# Altium project PROC101D_SCH_With_Design_Updates..Notes_V1.0.PrjPcb (part 20 of 23)

## Sheet 38.SchDoc
size 513 x 386 mm
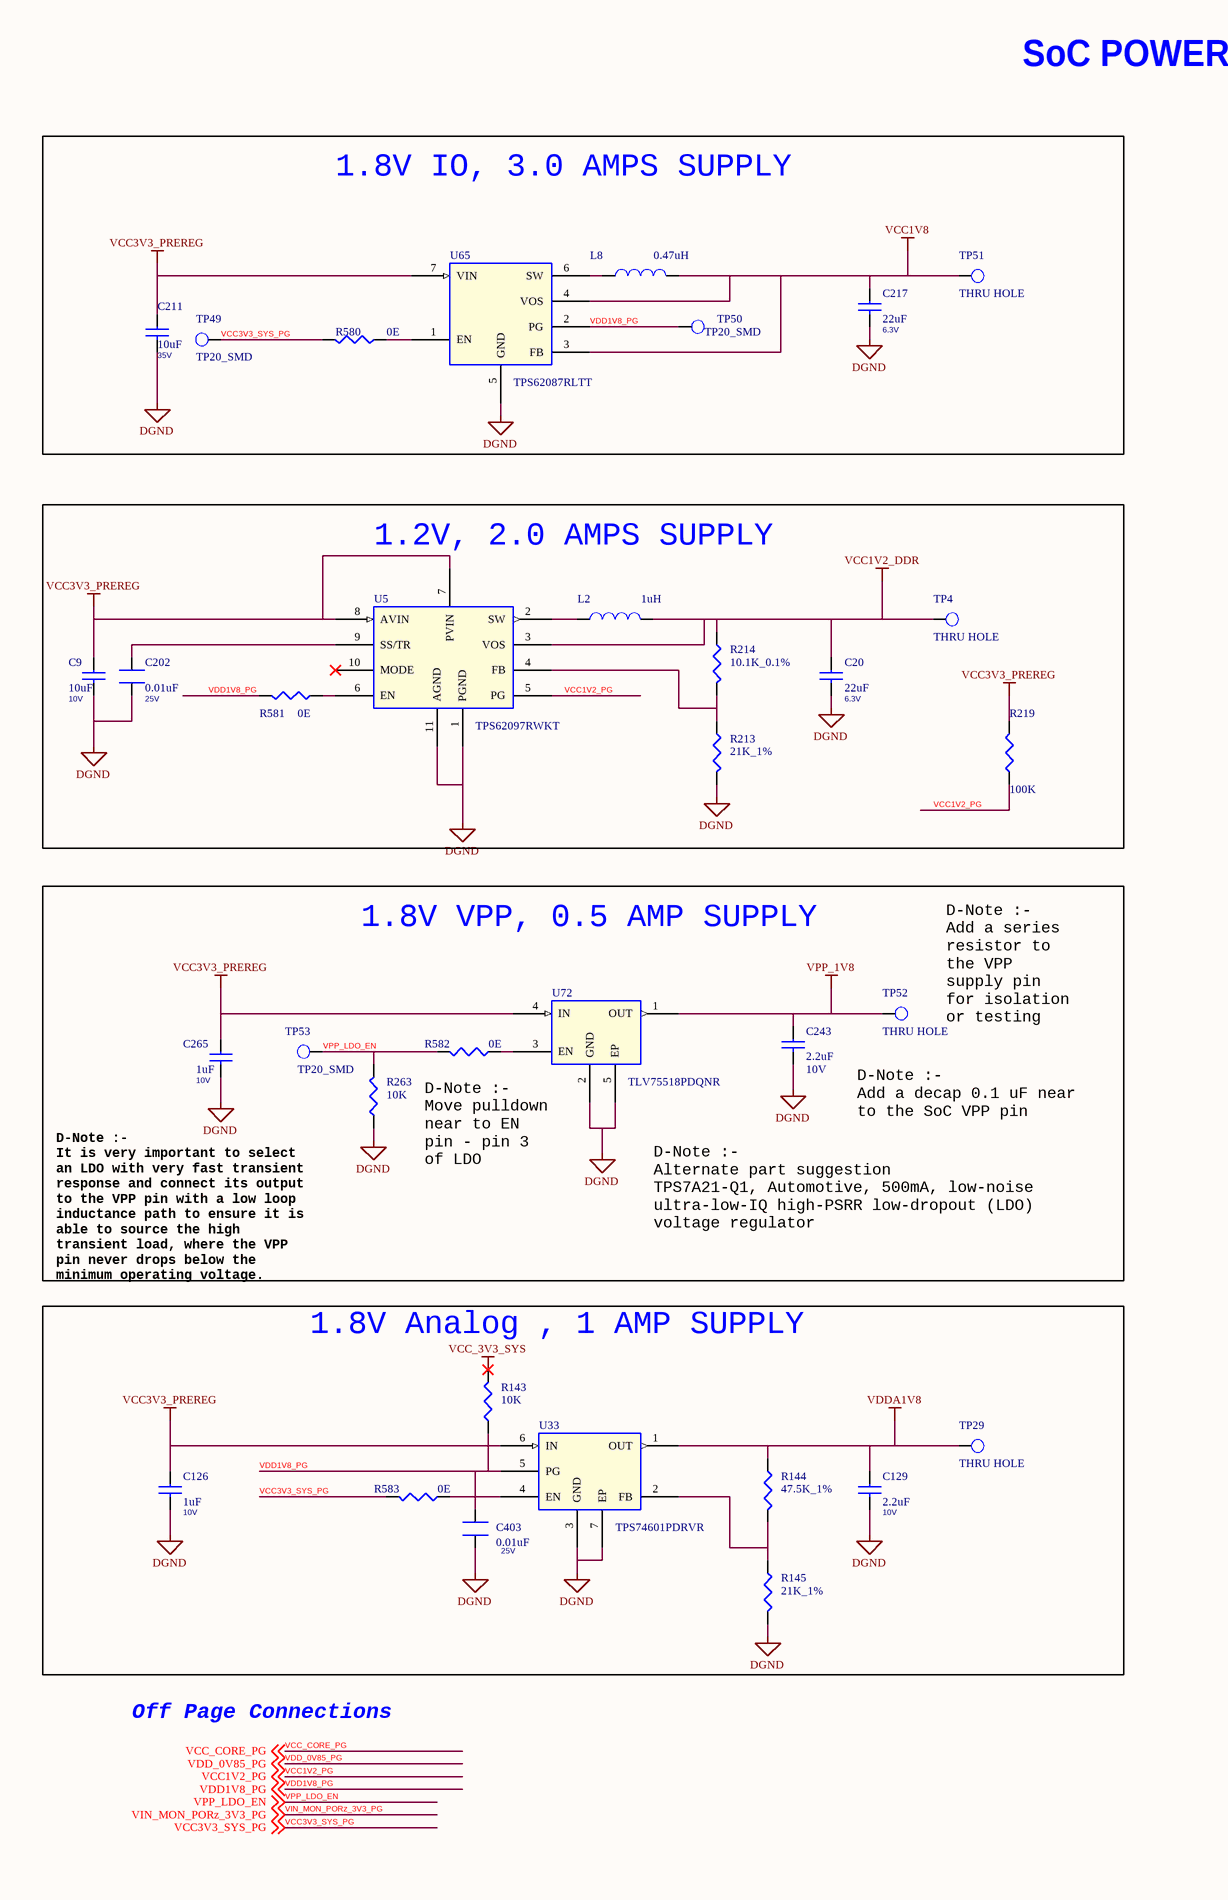
[diagram p72: 38.SchDoc, left]
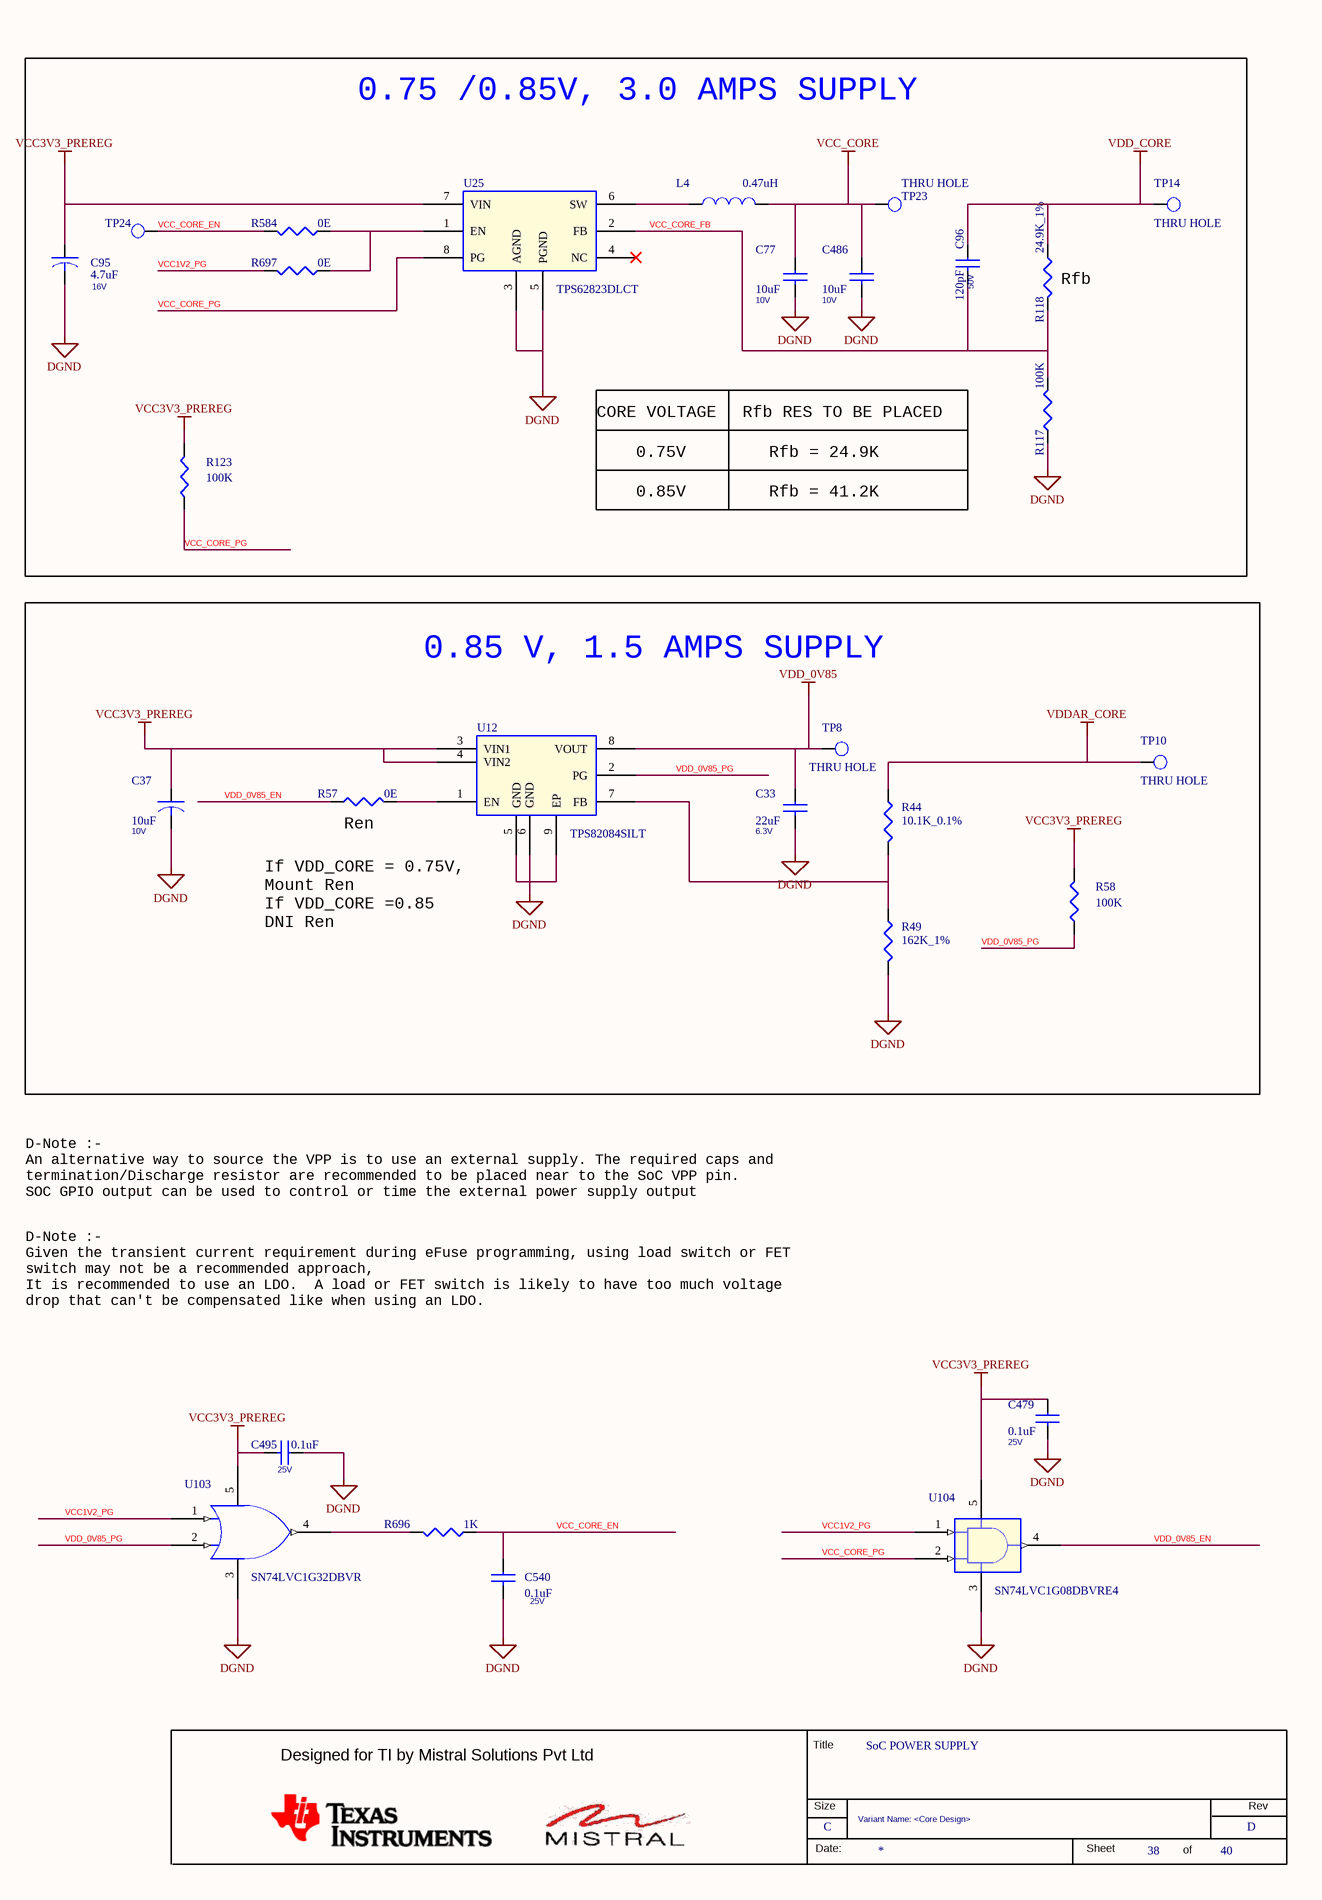
[diagram p73: 38.SchDoc, right]

### Parts
(Parts that share a designator on the sheet are numbered #1, #2 ... from top to bottom, then left to right.)
*#38  RevCode: D  Title: SoC POWER SUPPLY  Page Size: C  Page Number: 38  Page Count: 40  Variant Name: <Core Design>  (hidden comment: MISTRAL_TITLEBLK_CSIZE)  (graphical)
C9  10uF  Voltage: 10V  [CAP0402_0-75]
C20  22uF  Voltage: 6.3V  [CAP0603_1]
C33  22uF  Voltage: 6.3V  [CAP0603_1]
C37  10uF  Voltage: 10V  [CAP0402_0-75]
C77  10uF  Voltage: 10V  [CAP0402_0-75]
C95  4.7uF  Voltage: 16V  [CAP0603_1]
C96  120pF  Voltage: 50V  [CAP0402_0-75]
C126  1uF  Voltage: 10V  [CAP0402_0-75]
C129  2.2uF  Voltage: 10V  [CAP0402_0-75]
C202  0.01uF  Voltage: 25V  [CAP0402N]
C211  10uF  Voltage: 35V  [CAP0603_1]
C217  22uF  Voltage: 6.3V  [CAP0603_1]
C243  2.2uF  Voltage: 10V  [CAP0402_0-75]
C265  1uF  Voltage: 10V  [CAP0402_0-75]
C403  0.01uF  Voltage: 25V  [CAP0402N]
C479  0.1uF  Voltage: 25V  [CAP0402_0-75]
C486  10uF  Voltage: 10V  [CAP0402_0-75]
C495  0.1uF  Voltage: 25V  [CAP0402_0-75]
C540  0.1uF  Voltage: 25V  [CAP0402_0-75]
L2  1uH  [IND_744316100_230X220_SMD_4-3]
L4  0.47uH  [IND_744373460047_270X270_SMD_3]
L8  0.47uH  [IND_744373460047_270X270_SMD_3]
R44  10.1K_0.1%  [RES0603_0-75]
R49  162K_1%  [RES0402_0-5]
R57  0E  [RES0402_0-5]
R58  100K  [RES0402_0-5]
R117  100K  [RES0402_0-5]
R118  24.9K_1%  [RES0402_0-5]
R123  100K  [RES0402_0-5]
R143  10K  [RES0402_0-5]
R144  47.5K_1%  [RES0402_0-5]
R145  21K_1%  [RES0402_0-5]
R213  21K_1%  [RES0402_0-5]
R214  10.1K_0.1%  [RES0603_0-75]
R219  100K  [RES0402_0-5]
R263  10K  [RES0402_0-5]
R580  0E  [RES0402_0-5]
R581  0E  [RES0402_0-5]
R582  0E  [RES0402_0-5]
R583  0E  [RES0402_0-5]
R584  0E  [RES0402_0-5]
R696  1K  [RES0402_0-5]
R697  0E  [RES0402_0-5]
TP4  THRU HOLE  [TP_40X65]
TP8  THRU HOLE  [TP_40X65]
TP10  THRU HOLE  [TP_40X65]
TP14  THRU HOLE  [TP_40X65]
TP23  THRU HOLE  [TP_40X65]
TP24  TP20_SMD  [TP20_SMD]  (value not drawn)
TP29  THRU HOLE  [TP_40X65]
TP49  TP20_SMD  [TP20_SMD]
TP50  TP20_SMD  [TP20_SMD]
TP51  THRU HOLE  [TP_40X65]
TP52  THRU HOLE  [TP_40X65]
TP53  TP20_SMD  [TP20_SMD]
U5  TPS62097RWKT  [VQFNHR11_TPS62097_80X80_1]
U12  TPS82084SILT  [uSIP8_TPS82084_110X120_1-4]
U25  TPS62823DLCT  [VSONHR8_TPS62823_60X80_1]
U33  TPS74601PDRVR  [SON6_25-59_85X85_0-8]
U65  TPS62087RLTT  [VSONHR7_TPS62085_80X80_1]
U72  TLV75518PDQNR  [X2SON4_TLV71318P_40X40_0-4]
U103  SN74LVC1G32DBVR  [SOT23-5_1-5]
U104  SN74LVC1G08DBVRE4  [SOT23-5]

### Blocks framed on the sheet
1.8V IO, 3.0 AMPS SUPPLY: C211 C217 L8 R580 TP49-TP51 U65
0.75 /0.85V, 3.0 AMPS SUPPLY: C77 C95 C96 C486 L4 R117 R118 R123 R584 R697 TP14 TP23 TP24 U25
1.2V, 2.0 AMPS SUPPLY: C9 C20 C202 L2 R213 R214 R219 R581 TP4 U5
0.85 V, 1.5 AMPS SUPPLY: C33 C37 R44 R49 R57 R58 TP8 TP10 U12
1.8V VPP, 0.5 AMP SUPPLY: C243 C265 R263 R582 TP52 TP53 U72
1.8V Analog , 1 AMP SUPPLY: C126 C129 C403 R143-R145 R583 TP29 U33

### Nets
DGND: C9.2 C20.2 C33.2 C37.2 C77.2 C95.2 C126.2 C129.2 C202.2 C211.2 C217.2 C243.2 C265.2 C403.2 C479.2 C486.2 C495.1 C540.2 R49.2 R117.1 R145.2 R213.2 R263.1 U5.1(PGND) U5.11(AGND) U12.6(GND) U25.3(AGND) U25.5(PGND) U33.3(GND) U33.7(EP) U65.5(GND) U72.2(GND) U72.5(EP) U103.3(GND) U104.3(GND)
VCC1V2_DDR: C20.1 L2.2 R214.1 TP4.1(TP) U5.3(VOS)
VCC1V8: C217.1 L8.2 TP51.1(TP) U65.3(FB) U65.4(VOS)
VCC3V3_PREREG: C9.1 C37.1 C95.1 C126.1 C211.1 C265.1 C479.1 C495.2 R58.2 R123.2 R219.2 U5.7(PVIN) U5.8(AVIN) U12.3(VIN1) U12.4(VIN2) U25.7(VIN) U33.6(IN) U65.7(VIN) U72.4(IN) U103.5(VCC) U104.5(VCC)
VCC_3V3_SYS: R143.2
VCC_CORE: C77.1 C486.1 L4.2 TP23.1(TP)
VDD_0V85: C33.1 TP8.1(TP) U12.8(VOUT)
VDD_CORE: C96.1 R118.1 TP14.1(TP)
VDDA1V8: C129.1 R144.1 TP29.1(TP) U33.1(OUT)
VDDAR_CORE: R44.1 TP10.1(TP)
VPP_1V8: C243.1 TP52.1(TP) U72.1(OUT)
VCC1V2_PG: R219.1 R697.2 U5.5(PG) U103.1(A) U104.1(A) ; off-sheet VCC1V2_PG
VCC3V3_SYS_PG: R580.2 R583.2 TP49.1(TP) ; off-sheet VCC3V3_SYS_PG
VCC_CORE_EN: C540.1 R584.2 R696.1 TP24.1(TP)
VCC_CORE_FB: C96.2 R117.2 R118.2 U25.2(FB)
VCC_CORE_PG: R123.1 U25.8(PG) U104.2(B) ; off-sheet VCC_CORE_PG
VDD1V8_PG: C403.1 R143.1 R581.2 TP50.1(TP) U33.5(PG) U65.2(PG) ; off-sheet VDD1V8_PG
VDD_0V85_EN: R57.1 U104.4(Y)
VDD_0V85_PG: R58.1 U12.2(PG) U103.2(B) ; off-sheet VDD_0V85_PG
VPP_LDO_EN: R263.2 R582.2 TP53.1(TP) ; off-sheet VPP_LDO_EN
NetC202_1: C202.1 U5.9(SS/TR)
NetL2_1: L2.1 U5.2(SW)
NetL4_1: L4.1 U25.6(SW)
NetL8_1: L8.1 U65.6(SW)
NetR44_2: R44.2 R49.1 U12.7(FB)
NetR57_2: R57.2 U12.1(EN)
NetR144_2: R144.2 R145.1 U33.2(FB)
NetR213_1: R213.1 R214.2 U5.4(FB)
NetR580_1: R580.1 U65.1(EN)
NetR581_1: R581.1 U5.6(EN)
NetR582_1: R582.1 U72.3(EN)
NetR583_1: R583.1 U33.4(EN)
NetR584_1: R584.1 R697.1 U25.1(EN)
NetR696_2: R696.2 U103.4(Y)
NetU12_5: U12.5(GND) U12.9(EP)

Not connected (* = marked no-connect by the designer): U5 10(MODE)*; U25 4(NC)*

### Notes on the sheet
- SoC POWER SUPPLIES
- (near R118) Rfb
- CORE VOLTAGE
- Rfb RES TO BE PLACED
- 0.75V
- 0.85V
- Rfb = 24.9K
- Rfb = 41.2K
- (near R57) Ren
- D-Note :-
  Add a series
  resistor to
  the VPP
  supply pin
  for isolation
  or testing
- If VDD_CORE = 0.75V,
  Mount Ren
  If VDD_CORE =0.85
  DNI Ren
- (near U72) D-Note :-
  Move pulldown
  near to EN
  pin - pin 3
  of LDO
- D-Note :-
  Add a decap 0.1 uF near
  to the SoC VPP pin
- D-Note :-
  It is very important to select
  an LDO with very fast transient
  response and connect its output
  to the VPP pin with a low loop
  inductance path to ensure it is
  able to source the high
  transient load, where the VPP
  pin never drops below the
  minimum operating voltage.
- D-Note :-
  Alternate part suggestion
  TPS7A21-Q1, Automotive, 500mA, low-noise
  ultra-low-IQ high-PSRR low-dropout (LDO)
  voltage regulator
- D-Note :-
  An alternative way to source the VPP is to use an external supply. The required caps and
  termination/Discharge resistor are recommended to be placed near to the SoC VPP pin.
  SOC GPIO output can be used to control or time the external power supply output
- D-Note :-
  Given the transient current requirement during eFuse programming, using load switch or FET
  switch may not be a recommended approach,
  It is recommended to use an LDO.  A load or FET switch is likely to have too much voltage
  drop that can't be compensated like when using an LDO.
- Off Page Connections
- (in symbol MISTRAL_TITLEBLK_CSIZE) Title; Designed for TI by Mistral Solutions Pvt Ltd; Size; Rev; Date:; Sheet; of

### Library data of the parts
*#38 = MISTRAL_TITLEBLK_CSIZE: Issue: 1.0; Page Create Date: March  8, 1995; Page Modify Date: *
C9 C486 = CAP_Dup3: CAP CERAMIC 10uF 10V 20% X5R 0402; Part_type: CAPACITORS\CERAMIC; Mfr_part_number: GRM155R61A106ME11D; Mfr_name: MURATA; Mistral Part No: 120013110019-R; Custom_Duty: 15%; Customs_HS_Code: 85322990; Wattage: NA; Project: QCS610_NANOSOM; Footprint Path: Y:\MIS_DATABASE\Library\ALTIUM_TOOL\PCB_FOOTPRINTS\Altium_Footprint_Lib.PcbLib; Library Path: Y:\MIS_DATABASE\Library\ALTIUM_TOOL\SCHEMATICS_PARTS\MS_DISCRETE_Library.schlib; Footprint Ref: CAP0402_0-75; Library Ref: CAP; MECHANICAL 3D STEP FILE: CAP0402_0-75; Chkd/date: MANIRAJA/300520; Crtd /date: ALVY/260520; Datasheet: Y:\MIS_DATABASE\DATASHEETS\CAPACITORS\MURATA-GXX-SER_NOV17.PDF; Temperature: -55癈+85癈; Weight: 3.1mg; Height: 0.55MM; Distributor_part_number: 490-GRM155R61A106ME11DTR-ND; Distributor_name: DIGIKEY; Package: 0402; Tolerance: 20%; PCB Footprint: CAP0402_0-75
C20 C33 = CAP_Dup3: as C40 on sheet 37; Footprint Path: Y:\MIS_DATABASE\Library\ALTIUM_TOOL\PCB_FOOTPRINTS\Altium_Footprint_Lib.PcbLib; Library Path: Y:\MIS_DATABASE\Library\ALTIUM_TOOL\SCHEMATICS_PARTS\MS_DISCRETE_Library.schlib; MECHANICAL 3D STEP FILE: CAP0603_1; Footprint Ref: CAP0603_1; Library Ref: CAP; Tolerance: 20%; Package: 0603; Distributor_name: DIGIKEY; Distributor_part_number: 490-7611-2-ND; Height: 1.00MM; Weight: 6.3mg; Temperature: -55癈+85癈; Datasheet: Y:\MIS_DATABASE\DATASHEETS\CAPACITORS\MURATA-GXX-SER_NOV17.PDF; Crtd /date: JEBRAN/090915; Chkd/date: JEBRAN/090915; PCB Footprint: CAP0603_1
C37 = CAP_Dup1: CAP CERAMIC 10uF 10V 20% X5R 0402; Mistral Part No: 120013110019-R; Mfr_name: MURATA; Mfr_part_number: GRM155R61A106ME11D; Part_type: CAPACITORS\CERAMIC; Project: QCS610_NANOSOM; Wattage: NA; Customs_HS_Code: 85322990; Custom_Duty: 15%; Footprint Path: Y:\MIS_DATABASE\Library\ALTIUM_TOOL\PCB_FOOTPRINTS\Altium_Footprint_Lib.PcbLib; Library Path: Y:\MIS_DATABASE\Library\ALTIUM_TOOL\SCHEMATICS_PARTS\MS_DISCRETE_Library.schlib; Footprint Ref: CAP0402_0-75; Library Ref: CAP; MECHANICAL 3D STEP FILE: CAP0402_0-75; Tolerance: 20%; Package: 0402; Distributor_name: DIGIKEY; Distributor_part_number: 490-GRM155R61A106ME11DTR-ND; Height: 0.55MM; Weight: 3.1mg; Temperature: -55癈+85癈; Datasheet: Y:\MIS_DATABASE\DATASHEETS\CAPACITORS\MURATA-GXX-SER_NOV17.PDF; Crtd /date: ALVY/260520; Chkd/date: MANIRAJA/300520; PCB Footprint: CAP0402_0-75
C77 = CAP_Dup3: CAP CERAMIC 10uF 10V 20% X5R 0402; Mistral Part No: 120013110019-R; Mfr_name: MURATA; Mfr_part_number: GRM155R61A106ME11D; Part_type: CAPACITORS\CERAMIC; Project: QCS610_NANOSOM; Wattage: NA; Customs_HS_Code: 85322990; Custom_Duty: 15%; Tolerance: 20%; Package: 0402; Distributor_name: DIGIKEY; Distributor_part_number: 490-GRM155R61A106ME11DTR-ND; Height: 0.55MM; Weight: 3.1mg; Temperature: -55癈+85癈; Datasheet: Y:\MIS_DATABASE\DATASHEETS\CAPACITORS\MURATA-GXX-SER_NOV17.PDF; Crtd /date: ALVY/260520; Chkd/date: MANIRAJA/300520; MECHANICAL 3D STEP FILE: CAP0402_0-75; Library Ref: CAP; Footprint Ref: CAP0402_0-75; Library Path: Y:\MIS_DATABASE\Library\ALTIUM_TOOL\SCHEMATICS_PARTS\MS_DISCRETE_Library.schlib; Footprint Path: Y:\MIS_DATABASE\Library\ALTIUM_TOOL\PCB_FOOTPRINTS\Altium_Footprint_Lib.PcbLib; PCB Footprint: CAP0402_0-75
C95 = CAP_Dup1: CAP CERAMIC 4.7uF 16V 10% X5R 0603; Part_type: CAPACITORS\CERAMIC; Mfr_part_number: CC0603KRX5R7BB475; Mfr_name: YAGEO AMERICA; Mistral Part No: 120011050004-R; Custom_Duty: 15%; Customs_HS_Code: 85322990; Wattage: NA; Project: ASL_LIU_TYPE-II; Footprint Path: Y:\MIS_DATABASE\Library\ALTIUM_TOOL\PCB_FOOTPRINTS\Altium_Footprint_Lib.PcbLib; Library Path: Y:\MIS_DATABASE\Library\ALTIUM_TOOL\SCHEMATICS_PARTS\MS_DISCRETE_Library.schlib; MECHANICAL 3D STEP FILE: CAP0603_1; Chkd/date: MANIRAJA/131217; Crtd /date: ALVY/131217; Datasheet: Y:\MIS_DATABASE\DATASHEETS\CAPACITORS\YACC-X5R.PDF; Temperature: -55癈+85癈; Weight: 2mg; Height: 0.95MM; Library Ref: CAP; Distributor_part_number: 311-1785-1-ND; Distributor_name: DIGIKEY; Package: 0603; Tolerance: 10%; Footprint Ref: CAP0603_1; PCB Footprint: CAP0603_1
C96 = CAP: CAP CERAMIC 120pF 50V 5% C0G(NP0) 0402; Part_type: CAPACITORS\CERAMIC; Mfr_part_number: CC0402JRNPO9BN121; Mfr_name: YAGEO AMERICA; Mistral Part No: 120014040005-R; Custom_Duty: 15%; Customs_HS_Code: 85322990; Wattage: NA; Project: AM64x-GP_EVM BRD; Footprint Path: Y:\MIS_DATABASE\Library\ALTIUM_TOOL\PCB_FOOTPRINTS\Altium_Footprint_Lib.PcbLib; Library Path: Y:\MIS_DATABASE\Library\ALTIUM_TOOL\SCHEMATICS_PARTS\MS_DISCRETE_Library.schlib; MECHANICAL 3D STEP FILE: CAP0402_0-75; Chkd/date: MANIRAJA/080520; Crtd /date: ALVY/070520; Datasheet: Y:\MIS_DATABASE\DATASHEETS\CAPACITORS\YACC-NPO.PDF; Temperature: -55癈+125癈; Weight: 12mg; Height: 0.55MM; Library Ref: CAP; Distributor_part_number: 311-3337-1-ND; Distributor_name: DIGIKEY; Package: 0402; Tolerance: 5%; Footprint Ref: CAP0402_0-75; PCB Footprint: CAP0402_0-75
C126 C265 = CAP_Dup3: as C137 on sheet 37; PCB Footprint: CAP0402_0-75; Library Ref: CAP; MECHANICAL 3D STEP FILE: CAP0402_0-75; Chkd/date: MANIRAJA/210820; Crtd /date: ALVY/190820; Datasheet: Y:\MIS_DATABASE\DATASHEETS\CAPACITORS\885012105012.PDF; Temperature: -55癈+85癈; Weight: 0.65mg; Height: 0.55MM; Distributor_part_number: 732-7489-1-ND; Distributor_name: DIGIKEY; Package: 0402; Tolerance: 20%; Footprint Ref: CAP0402_0-75; Library Path: Y:\MIS_DATABASE\Library\ALTIUM_TOOL\SCHEMATICS_PARTS\MS_DISCRETE_Library.schlib; Footprint Path: Y:\MIS_DATABASE\Library\ALTIUM_TOOL\PCB_FOOTPRINTS\Altium_Footprint_Lib.PcbLib
C129 C243 = CAP_Dup3: CAP CERAMIC 2.2uF 10V 20% X5R 0402; Mistral Part No: 120019040036-R; Mfr_name: WURTH ELECTRONICS; Mfr_part_number: 885012105013; Part_type: CAPACITORS\CERAMIC; Project: AM64x_EVM_BRD; Wattage: NA; Customs_HS_Code: 85322990; Custom_Duty: 15%; PCB Footprint: CAP0402_0-75; Library Ref: CAP; Tolerance: 20%; Package: 0402; Distributor_name: DIGIKEY; Distributor_part_number: 732-7490-1-ND; Height: 0.55MM; Weight: 0.65mg; Temperature: -55癈+85癈; Datasheet: Y:\MIS_DATABASE\DATASHEETS\CAPACITORS\885012105013.PDF; Crtd /date: ALVY/170820; Chkd/date: MANIRAJA/170820; MECHANICAL 3D STEP FILE: CAP0402_0-75; Footprint Ref: CAP0402_0-75; Library Path: Y:\MIS_DATABASE\Library\ALTIUM_TOOL\SCHEMATICS_PARTS\MS_DISCRETE_Library.schlib; Footprint Path: Y:\MIS_DATABASE\Library\ALTIUM_TOOL\PCB_FOOTPRINTS\Altium_Footprint_Lib.PcbLib
C202 = CAP_Dup2: CAP CERAMIC 0.01uF 25V 10% X7R 0402; Part_type: CAPACITORS\CERAMIC; Mfr_part_number: 885012205050; Mfr_name: WURTH ELECTRONICS; Mistral Part No: 120011090040-R; MECHANICAL 3D STEP FILE: CAP0402_0-75; Wattage: NA; Custom_Duty: 15%; Customs_HS_Code: 85322990; Project: AM64x_EVM_BRD; Footprint Path: Y:\MIS_DATABASE\Library\ALTIUM_TOOL\PCB_FOOTPRINTS\Altium_Footprint_Lib.PcbLib; Library Path: Y:\MIS_DATABASE\Library\ALTIUM_TOOL\SCHEMATICS_PARTS\MS_DISCRETE_Library.schlib; Footprint Ref: CAP0402_0-75; Temperature: -55癈+125癈; Weight: 0.65mg; Chkd/date: MANIRAJA/170820; Crtd /date: ALVY/170820; Datasheet: Y:\MIS_DATABASE\DATASHEETS\CAPACITORS\885012205050.PDF; Height: 0.55MM; Distributor_part_number: 732-7545-1-ND; Distributor_name: DIGIKEY; Package: 0402; Tolerance: 10%; Library Ref: CAP; PCB Footprint: CAP0402_0-75
C211 = CAP_Dup3: CAP CERAMIC 10uF 35V 20% X5R 0603; Mistral Part No: 120019050016-R; Mfr_name: MURATA; Mfr_part_number: GRM188R6YA106MA73D; Part_type: CAPACITORS\CERAMIC; Project: BRUKER_SD820_COMMONDO; Wattage: NA; Customs_HS_Code: 85322990; Custom_Duty: 15%; Footprint Path: Y:\MIS_DATABASE\Library\ALTIUM_TOOL\PCB_FOOTPRINTS\Altium_Footprint_Lib.PcbLib; Library Path: Y:\MIS_DATABASE\Library\ALTIUM_TOOL\SCHEMATICS_PARTS\MS_DISCRETE_Library.schlib; Footprint Ref: CAP0603_1; Tolerance: 20%; Package: 0603; Distributor_name: DIGIKEY; Distributor_part_number: 490-13248-1-ND; Height: 1.00MM; Weight: 9mg; Temperature: -55癈+85癈; Datasheet: Y:\MIS_DATABASE\DATASHEETS\CAPACITORS\GRM188R6YA106MA73.PDF; Crtd /date: ALVY/160519; Chkd/date: MANIRAJA/170519; MECHANICAL 3D STEP FILE: CAP0603_1; Library Ref: CAP; PCB Footprint: CAP0603_1
C217 = CAP_Dup3: as C46 on sheet 37; Library Ref: CAP; Chkd/date: JEBRAN/090915; Crtd /date: JEBRAN/090915; Datasheet: Y:\MIS_DATABASE\DATASHEETS\CAPACITORS\MURATA-GXX-SER_NOV17.PDF; Temperature: -55癈+85癈; Weight: 6.3mg; Height: 1.00MM; Distributor_part_number: 490-7611-2-ND; Distributor_name: DIGIKEY; Package: 0603; Tolerance: 20%; Footprint Ref: CAP0603_1; MECHANICAL 3D STEP FILE: CAP0603_1; Library Path: Y:\MIS_DATABASE\Library\ALTIUM_TOOL\SCHEMATICS_PARTS\MS_DISCRETE_Library.schlib; Footprint Path: Y:\MIS_DATABASE\Library\ALTIUM_TOOL\PCB_FOOTPRINTS\Altium_Footprint_Lib.PcbLib; PCB Footprint: CAP0603_1
C403 = CAP_Dup2: as C406 on sheet 37; Library Ref: CAP; Tolerance: 10%; Package: 0402; Distributor_name: DIGIKEY; Distributor_part_number: 732-7545-1-ND; Height: 0.55MM; Datasheet: Y:\MIS_DATABASE\DATASHEETS\CAPACITORS\885012205050.PDF; Crtd /date: ALVY/170820; Chkd/date: MANIRAJA/170820; Weight: 0.65mg; Temperature: -55癈+125癈; MECHANICAL 3D STEP FILE: CAP0402_0-75; Footprint Ref: CAP0402_0-75; Library Path: Y:\MIS_DATABASE\Library\ALTIUM_TOOL\SCHEMATICS_PARTS\MS_DISCRETE_Library.schlib; Footprint Path: Y:\MIS_DATABASE\Library\ALTIUM_TOOL\PCB_FOOTPRINTS\Altium_Footprint_Lib.PcbLib
C479 = CAP_Dup3: as C116 on sheet 37; Footprint Path: Y:\MIS_DATABASE\Library\ALTIUM_TOOL\PCB_FOOTPRINTS\Altium_Footprint_Lib.PcbLib; Library Path: Y:\MIS_DATABASE\Library\ALTIUM_TOOL\SCHEMATICS_PARTS\MS_DISCRETE_Library.schlib; Footprint Ref: CAP0402_0-75; Library Ref: CAP; MECHANICAL 3D STEP FILE: CAP0402_0-75; Chkd/date: MANIRAJA/170820; Crtd /date: ALVY/170820; Datasheet: Y:\MIS_DATABASE\DATASHEETS\CAPACITORS\885012105018.PDF; Temperature: -55癈+85癈; Weight: 0.65mg; Height: 0.55MM; Distributor_part_number: 732-7495-1-ND; Distributor_name: DIGIKEY; Package: 0402; Tolerance: 20%; PCB Footprint: CAP0402_0-75
C495 C540 = CAP_Dup3: as C54 on sheet 37; Tolerance: 20%; Package: 0402; Distributor_name: DIGIKEY; Distributor_part_number: 732-7495-1-ND; Height: 0.55MM; Weight: 0.65mg; Temperature: -55癈+85癈; Datasheet: Y:\MIS_DATABASE\DATASHEETS\CAPACITORS\885012105018.PDF; Crtd /date: ALVY/170820; Chkd/date: MANIRAJA/170820; MECHANICAL 3D STEP FILE: CAP0402_0-75; Library Ref: CAP; Footprint Ref: CAP0402_0-75; Library Path: Y:\MIS_DATABASE\Library\ALTIUM_TOOL\SCHEMATICS_PARTS\MS_DISCRETE_Library.schlib; Footprint Path: Y:\MIS_DATABASE\Library\ALTIUM_TOOL\PCB_FOOTPRINTS\Altium_Footprint_Lib.PcbLib; PCB Footprint: CAP0402_0-75
L2 = INDUCTOR: IND HI-CURRENT 1uH 11.5A 20% SMD; Mistral Part No: 130020050041-R; Mfr_name: WURTH ELECTRONICS; Mfr_part_number: 744316100; Project: AM64x-GP_EVM BRD; Voltage: NA; Customs_HS_Code: 85437099; Custom_Duty: 24%; Footprint Ref: IND_744316100_230X220_SMD_4-3; Part_type: INDUCTOR; Tolerance: 20%; Wattage: NA; Package: SMD; Distributor_name: DIGIKEY; Distributor_part_number: 732-6176-1-ND; Library Ref: INDUCTOR; Height: 4.30MM; Weight: 570mg; Temperature: -40癈+150癈; Datasheet: Y:\MIS_DATABASE\DATASHEETS\DISCRETES\INDUCTORS\744316100.PDF; Crtd /date: ALVY/280520; Chkd/date: MANIRAJA/280520; MECHANICAL 3D STEP FILE: IND_744316100_230X220_SMD_4-3; Library Path: Y:\MIS_DATABASE\Library\ALTIUM_TOOL\SCHEMATICS_PARTS\MS_DISCRETE_Library.schlib; Footprint Path: Y:\MIS_DATABASE\Library\ALTIUM_TOOL\PCB_FOOTPRINTS\Altium_Footprint_Lib.PcbLib; PCB Footprint: IND_744316100_230X220_SMD_4-3
L4 L8 = INDUCTOR: IND POWER 0.47uH 11.5A 20% SMD; Mistral Part No: 130020080011-R; Mfr_name: WURTH ELECTRONICS; Mfr_part_number: 744373460047; Project: AM64x_EVM_BRD; Voltage: NA; Customs_HS_Code: 85437099; Custom_Duty: 24%; Footprint Ref: IND_744373460047_270X270_SMD_3; Part_type: INDUCTOR; Tolerance: 20%; Wattage: NA; Package: SMD; Distributor_name: DIGIKEY; Distributor_part_number: 732-3366-1-ND; Library Ref: INDUCTOR; Height: 3.00MM; Weight: 719mg; Temperature: -40癈+125癈; Datasheet: Y:\MIS_DATABASE\DATASHEETS\DISCRETES\INDUCTORS\744373460047.PDF; Crtd /date: ALVY/130820; Chkd/date: MANIRAJA/130820; MECHANICAL 3D STEP FILE: IND_744373460047_270X270_SMD_3; Library Path: Y:\MIS_DATABASE\Library\ALTIUM_TOOL\SCHEMATICS_PARTS\MS_DISCRETE_Library.schlib; Footprint Path: Y:\MIS_DATABASE\Library\ALTIUM_TOOL\PCB_FOOTPRINTS\Altium_Footprint_Lib.PcbLib; PCB Footprint: IND_744373460047_270X270_SMD_3
R44 = RESISTOR_Dup1: RES 10.1K 1/8W 0.1% AUTO 0603; Mistral Part No: 110020040008-R; Mfr_name: VISHAY; Mfr_part_number: TNPW060310K1BEEA; Part_type: RESISTORS\FIXED; Project: AM64x-GP_EVM BRD; Voltage: NA; Customs_HS_Code: 85332119; Custom_Duty: 15%; Footprint Ref: RES0603_0-75; Tolerance: 0.1%; Wattage: 1/8W; Package: 0603; Distributor_name: DIGIKEY; Distributor_part_number: 541-3907-1-ND; Library Ref: RESISTOR; Height: 0.55MM; Weight: 25mg; Temperature: -55癈+155癈; Datasheet: Y:\MIS_DATABASE\DATASHEETS\RESISTORS\VISHAY_TNPWE3.PDF; Crtd /date: ALVY/080420; Chkd/date: MANIRAJA/090420; MECHANICAL 3D STEP FILE: RES0603_0-75; Library Path: Y:\MIS_DATABASE\Library\ALTIUM_TOOL\SCHEMATICS_PARTS\MS_DISCRETE_Library.schlib; Footprint Path: Y:\MIS_DATABASE\Library\ALTIUM_TOOL\PCB_FOOTPRINTS\Altium_Footprint_Lib.PcbLib; PCB Footprint: RES0603_0-75
R49 = RESISTOR: RES 162K 1/10W 1% 0402; Part_type: RESISTORS\FIXED; Mfr_part_number: ERJ-2RKF1623X; Mfr_name: PANASONIC-ECG; Mistral Part No: 110010060019-R; Custom_Duty: 15%; Customs_HS_Code: 85332119; Voltage: NA; Project: CENTAURUS; Footprint Path: Y:\MIS_DATABASE\Library\ALTIUM_TOOL\PCB_FOOTPRINTS\Altium_Footprint_Lib.PcbLib; Library Path: Y:\MIS_DATABASE\Library\ALTIUM_TOOL\SCHEMATICS_PARTS\MS_DISCRETE_Library.schlib; MECHANICAL 3D STEP FILE: RES0402_0-5; Chkd/date: SUHAS/270910; Crtd /date: MUDDU/190610; Datasheet: Y:\MIS_DATABASE\DATASHEETS\RESISTORS\PAN-ERJSER_NOV17.PDF; Temperature: -55癈+155癈; Weight: 0.8mg; Height: 0.40MM; Library Ref: RESISTOR; Distributor_part_number: P162KLCT-ND; Distributor_name: DIGIKEY; Package: 0402; Wattage: 1/10W; Tolerance: 1%; Footprint Ref: RES0402_0-5; PCB Footprint: RES0402_0-5
R57 R580-R583 = RESISTOR_Dup5: as R577-R579 on sheet 37; MECHANICAL 3D STEP FILE: RES0402_0-5; Chkd/date: VASANTHA/201216; Crtd /date: MUDDU/190810; Datasheet: Y:\MIS_DATABASE\DATASHEETS\RESISTORS\CRCW0603.PDF; Temperature: -55癈+155癈; Weight: 0.65mg; Height: 0.40MM; Distributor_part_number: 541-0.0JCT-ND; Distributor_name: DIGIKEY; Package: 0402; Wattage: 1/16W; Tolerance: NA; Library Ref: RESISTOR; Footprint Ref: RES0402_0-5; Library Path: Y:\MIS_DATABASE\Library\ALTIUM_TOOL\SCHEMATICS_PARTS\MS_DISCRETE_Library.schlib; Footprint Path: Y:\MIS_DATABASE\Library\ALTIUM_TOOL\PCB_FOOTPRINTS\Altium_Footprint_Lib.PcbLib; PCB Footprint: RES0402_0-5
R58 R117 R123 R219 = RESISTOR_Dup6: as R134 on sheet 37; PCB Footprint: RES0402_0-5; Library Ref: RESISTOR; MECHANICAL 3D STEP FILE: RES0402_0-5; Chkd/date: VASANTHA/061216; Crtd /date: BAVISH/010611; Datasheet: Y:\MIS_DATABASE\DATASHEETS\RESISTORS\CRCW0603.PDF; Temperature: -55癈+155癈; Weight: 0.65mg; Height: 0.40MM; Distributor_part_number: 541-100KJCT-ND; Distributor_name: DIGIKEY; Package: 0402; Wattage: 1/16W; Tolerance: 5%; Footprint Ref: RES0402_0-5; Library Path: Y:\MIS_DATABASE\Library\ALTIUM_TOOL\SCHEMATICS_PARTS\MS_DISCRETE_Library.schlib; Footprint Path: Y:\MIS_DATABASE\Library\ALTIUM_TOOL\PCB_FOOTPRINTS\Altium_Footprint_Lib.PcbLib
R118 = RESISTOR: RES 24.9K 1/16W 1% 0402; Mistral Part No: 110009030538-R; Mfr_name: VISHAY; Mfr_part_number: CRCW040224K9FKED; Part_type: RESISTORS\FIXED; Project: AM64x-GP_EVM BRD; Voltage: NA; Customs_HS_Code: 85332119; Custom_Duty: 15%; Footprint Ref: RES0402_0-5; Tolerance: 1%; Wattage: 1/16W; Package: 0402; Distributor_name: DIGIKEY; Distributor_part_number: 541-24.9KLCT-ND; Library Ref: RESISTOR; Height: 0.40MM; Weight: 0.65mg; Temperature: -55癈+155癈; Datasheet: Y:\MIS_DATABASE\DATASHEETS\RESISTORS\CRCW0603.PDF; Crtd /date: ALVY/070520; Chkd/date: MANIRAJA/080520; MECHANICAL 3D STEP FILE: RES0402_0-5; Library Path: Y:\MIS_DATABASE\Library\ALTIUM_TOOL\SCHEMATICS_PARTS\MS_DISCRETE_Library.schlib; Footprint Path: Y:\MIS_DATABASE\Library\ALTIUM_TOOL\PCB_FOOTPRINTS\Altium_Footprint_Lib.PcbLib; PCB Footprint: RES0402_0-5
R143 R263 = RESISTOR_Dup6: as R602 on sheet 37; PCB Footprint: RES0402_0-5; Tolerance: 5%; Wattage: 1/16W; Package: 0402; Distributor_name: DIGIKEY; Distributor_part_number: 311-10KJRCT-ND; Height: 0.40MM; Weight: 0.65mg; Temperature: -55癈+155癈; Datasheet: Y:\MIS_DATABASE\DATASHEETS\RESISTORS\RCXXXXL-SER_MAR18.PDF; Crtd /date: MAZHAR/230805; Chkd/date: VASANTHA/061216; MECHANICAL 3D STEP FILE: RES0402_0-5; Library Ref: RESISTOR; Footprint Ref: RES0402_0-5; Library Path: Y:\MIS_DATABASE\Library\ALTIUM_TOOL\SCHEMATICS_PARTS\MS_DISCRETE_Library.schlib; Footprint Path: Y:\MIS_DATABASE\Library\ALTIUM_TOOL\PCB_FOOTPRINTS\Altium_Footprint_Lib.PcbLib
R144 = RESISTOR_Dup6: RES 47.5K 1/16W 1% 0402; Part_type: RESISTORS\FIXED; Mfr_part_number: CRCW040247K5FKED; Mfr_name: VISHAY; Mistral Part No: 110017010006-R; Custom_Duty: 15%; Customs_HS_Code: 85332119; Voltage: NA; Project: TPR12_SVB; PCB Footprint: RES0402_0-5; MECHANICAL 3D STEP FILE: RES0402_0-5; Chkd/date: MANIRAJA/170320; Crtd /date: MANIRAJA/170320; Datasheet: Y:\MIS_DATABASE\DATASHEETS\RESISTORS\CRCW0603.PDF; Temperature: -55癈+155癈; Weight: 0.65mg; Height: 0.40MM; Distributor_part_number: 541-47.5KLCT-ND; Distributor_name: DIGIKEY; Package: 0402; Wattage: 1/16W; Tolerance: 1%; Library Ref: RESISTOR; Footprint Ref: RES0402_0-5; Library Path: Y:\MIS_DATABASE\Library\ALTIUM_TOOL\SCHEMATICS_PARTS\MS_DISCRETE_Library.schlib; Footprint Path: Y:\MIS_DATABASE\Library\ALTIUM_TOOL\PCB_FOOTPRINTS\Altium_Footprint_Lib.PcbLib
R145 = RESISTOR_Dup6: RES 21K 1/16W 1% 0402; Part_type: RESISTORS\FIXED; Mfr_part_number: RC0402FR-0721KL; Mfr_name: YAGEO AMERICA; Mistral Part No: 110015080019-R; Custom_Duty: 15%; Customs_HS_Code: 85332119; Project: OCTASIC_3000; Voltage: NA; PCB Footprint: RES0402_0-5; Footprint Path: Y:\MIS_DATABASE\Library\ALTIUM_TOOL\PCB_FOOTPRINTS\Altium_Footprint_Lib.PcbLib; Library Path: Y:\MIS_DATABASE\Library\ALTIUM_TOOL\SCHEMATICS_PARTS\MS_DISCRETE_Library.schlib; Footprint Ref: RES0402_0-5; Library Ref: RESISTOR; Chkd/date: MANIRAJA/200319; Crtd /date: MANIRAJA/200319; Datasheet: Y:\MIS_DATABASE\DATASHEETS\RESISTORS\RCXXXXL-SER_MAR18.PDF; Temperature: -55癈+155癈; Weight: 0.65mg; Height: 0.40MM; Distributor_part_number: 311-21.0KLRCT-ND; Distributor_name: DIGIKEY; Package: 0402; Wattage: 1/16W; Tolerance: 1%; MECHANICAL 3D STEP FILE: RES0402_0-5
R213 = RESISTOR_Dup6: RES 21K 1/16W 1% 0402; Part_type: RESISTORS\FIXED; Mfr_part_number: RC0402FR-0721KL; Mfr_name: YAGEO AMERICA; Mistral Part No: 110015080019-R; Voltage: NA; Custom_Duty: 15%; Customs_HS_Code: 85332119; Project: OCTASIC_3000; MECHANICAL 3D STEP FILE: RES0402_0-5; Footprint Path: Y:\MIS_DATABASE\Library\ALTIUM_TOOL\PCB_FOOTPRINTS\Altium_Footprint_Lib.PcbLib; Library Path: Y:\MIS_DATABASE\Library\ALTIUM_TOOL\SCHEMATICS_PARTS\MS_DISCRETE_Library.schlib; Footprint Ref: RES0402_0-5; Library Ref: RESISTOR; Chkd/date: MANIRAJA/200319; Crtd /date: MANIRAJA/200319; Datasheet: Y:\MIS_DATABASE\DATASHEETS\RESISTORS\RCXXXXL-SER_MAR18.PDF; Temperature: -55癈+155癈; Weight: 0.65mg; Height: 0.40MM; Distributor_part_number: 311-21.0KLRCT-ND; Distributor_name: DIGIKEY; Package: 0402; Wattage: 1/16W; Tolerance: 1%; PCB Footprint: RES0402_0-5
R214 = RESISTOR_Dup6: RES 10.1K 1/8W 0.1% AUTO 0603; Part_type: RESISTORS\FIXED; Mfr_part_number: TNPW060310K1BEEA; Mfr_name: VISHAY; Mistral Part No: 110020040008-R; Custom_Duty: 15%; Customs_HS_Code: 85332119; Voltage: NA; Project: AM64x-GP_EVM BRD; Footprint Path: Y:\MIS_DATABASE\Library\ALTIUM_TOOL\PCB_FOOTPRINTS\Altium_Footprint_Lib.PcbLib; Library Path: Y:\MIS_DATABASE\Library\ALTIUM_TOOL\SCHEMATICS_PARTS\MS_DISCRETE_Library.schlib; MECHANICAL 3D STEP FILE: RES0603_0-75; Footprint Ref: RES0603_0-75; Library Ref: RESISTOR; Chkd/date: MANIRAJA/090420; Crtd /date: ALVY/080420; Datasheet: Y:\MIS_DATABASE\DATASHEETS\RESISTORS\VISHAY_TNPWE3.PDF; Temperature: -55癈+155癈; Weight: 25mg; Height: 0.55MM; Distributor_part_number: 541-3907-1-ND; Distributor_name: DIGIKEY; Package: 0603; Wattage: 1/8W; Tolerance: 0.1%; PCB Footprint: RES0603_0-75
R584 R697 = RESISTOR_Dup5: as R412 on sheet 37; PCB Footprint: RES0402_0-5; Footprint Path: Y:\MIS_DATABASE\Library\ALTIUM_TOOL\PCB_FOOTPRINTS\Altium_Footprint_Lib.PcbLib; Library Path: Y:\MIS_DATABASE\Library\ALTIUM_TOOL\SCHEMATICS_PARTS\MS_DISCRETE_Library.schlib; Footprint Ref: RES0402_0-5; Library Ref: RESISTOR; Voltage: NA; Wattage: 1/16W; Package: 0402; Distributor_name: DIGIKEY; Distributor_part_number: 541-0.0JCT-ND; Height: 0.40MM; Weight: 0.65mg; Temperature: -55癈+155癈; Datasheet: Y:\MIS_DATABASE\DATASHEETS\RESISTORS\CRCW0603.PDF; Crtd /date: MUDDU/190810; Chkd/date: VASANTHA/201216; MECHANICAL 3D STEP FILE: RES0402_0-5
R696 = RESISTOR_Dup5: RES 1K 1/10W 5% 0402; Mistral Part No: 110009030400-R; Mfr_name: PANASONIC-ECG; Mfr_part_number: ERJ-2GEJ102X; Part_type: RESISTORS\FIXED; Project: HSE; Voltage: NA; Customs_HS_Code: 85332119; Custom_Duty: 15%; Footprint Path: Y:\MIS_DATABASE\Library\ALTIUM_TOOL\PCB_FOOTPRINTS\Altium_Footprint_Lib.PcbLib; Library Path: Y:\MIS_DATABASE\Library\ALTIUM_TOOL\SCHEMATICS_PARTS\MS_DISCRETE_Library.schlib; MECHANICAL 3D STEP FILE: RES0402_0-5; Footprint Ref: RES0402_0-5; Library Ref: RESISTOR; Tolerance: 5%; Wattage: 1/10W; Package: 0402; Distributor_name: DIGIKEY; Distributor_part_number: P1.0KJCT-ND; Height: 0.40MM; Weight: 0.8mg; Temperature: -55癈+155癈; Datasheet: Y:\MIS_DATABASE\DATASHEETS\RESISTORS\PAN-ERJSER_NOV17.PDF; Crtd /date: MAZHAR/230805; Chkd/date: VASANTHA/201216; PCB Footprint: RES0402_0-5
TP4 TP10 TP14 TP23 TP52 = TESTPOINT: as TP12 on sheet 37; Library Ref: TESTPOINT; Chkd/date: MAZHAR/271211; Crtd /date: SHREESHAIL/041005; Datasheet: NA; Height: NA; Distributor_part_number: NA; Distributor_name: NA; Package: THRU-HOLE; Part_type: TESTPOINT; Mfr_part_number: TP_40X65; PCB Footprint: TP_40X65
TP8 TP29 TP51 = TESTPOINT: as TP18 on sheet 37; Mfr_part_number: TP_40X65; Part_type: TESTPOINT; Package: THRU-HOLE; Distributor_name: NA; Distributor_part_number: NA; Height: NA; Datasheet: NA; Crtd /date: SHREESHAIL/041005; Chkd/date: MAZHAR/271211; Library Ref: TESTPOINT; PCB Footprint: TP_40X65
TP24 TP49 = TESTPOINT: TESTPOINT CIR 20 SMD; Mfr_name: LOCAL; Custom_Duty: NA; Project: BT MODULE_CSRBC04; PCB Footprint: TP20_SMD; Customs_HS_Code: NA; Mistral Part No: NA; Mfr_part_number: TP20_SMD; Part_type: TESTPOINT; Package: SMD; Distributor_name: NA; Distributor_part_number: NA; Height: NA; Crtd /date: MAZHAR/171006; Chkd/date: SHREESHAIL/171006; Tolerance: NA; Voltage: NA; Wattage: NA; Weight: NA; Temperature: NA; Datasheet: NA; MECHANICAL 3D STEP FILE: NA; Library Path: Y:\MIS_DATABASE\Library\ALTIUM_TOOL\SCHEMATICS_PARTS\MS_DISCRETE_Library.schlib; Footprint Path: Y:\MIS_DATABASE\Library\ALTIUM_TOOL\PCB_FOOTPRINTS\Altium_Footprint_Lib.PcbLib; Library Ref: TESTPOINT; Footprint Ref: TP20_SMD; RoHS: NA
TP50 TP53 = TESTPOINT: TESTPOINT CIR 20 SMD; Mfr_name: LOCAL; MECHANICAL 3D STEP FILE: NA; Project: BT MODULE_CSRBC04; Footprint Path: Y:\MIS_DATABASE\Library\ALTIUM_TOOL\PCB_FOOTPRINTS\Altium_Footprint_Lib.PcbLib; Library Path: Y:\MIS_DATABASE\Library\ALTIUM_TOOL\SCHEMATICS_PARTS\MS_DISCRETE_Library.schlib; Datasheet: NA; Temperature: NA; Weight: NA; Wattage: NA; Voltage: NA; Tolerance: NA; Chkd/date: SHREESHAIL/171006; Crtd /date: MAZHAR/171006; Height: NA; Distributor_part_number: NA; Distributor_name: NA; Package: SMD; Part_type: TESTPOINT; Mfr_part_number: TP20_SMD; Mistral Part No: NA; Library Ref: TESTPOINT; Footprint Ref: TP20_SMD; RoHS: NA; PCB Footprint: TP20_SMD; Customs_HS_Code: NA; Custom_Duty: NA
U5 = TPS62097RWKT_VQFNHR11: IC 2A SYNCHRONOUS STEP DOWN CONVERTER WITH IDCS CONTROL VQFN-HR11; Part_type: ICS\POWER\CONVERTER; Mfr_name: TEXAS INSTRUMENTS; Mistral Part No: 142017090025-R; Custom_Duty: 15%; Customs_HS_Code: 85423100; Wattage: NA; Project: TI_MAXIE_CPB; MECHANICAL 3D STEP FILE: VQFNHR11_TPS62097_80X80_1; Chkd/date: MANIRAJA/270917; Crtd /date: MANIRAJA/270917; Datasheet: Y:\MIS_DATABASE\DATASHEETS\ICS\POWER\TPS62097.PDF; Temperature: -40癈+125癈; Weight: NA; Height: 1.00MM; Distributor_part_number: 296-43330-1-ND; Distributor_name: DIGIKEY; Package: VQFN-HR11; Voltage: NA; Tolerance: NA; Mfr_part_number: TPS62097RWKT; Library Ref: TPS62097RWKT_VQFNHR11; PCB Footprint: VQFNHR11_TPS62097_80X80_1
U12 = TPS82084_USIP8: IC 2A STEP DOWN CONVERTER MICROSIP POWER MODULE WITH INTEGRATED INDUCTOR uSIP8; Part_type: ICS\POWER\POWER MODULE; Mfr_name: TEXAS INSTRUMENTS; Mistral Part No: 142020040012-R; Custom_Duty: 15%; Customs_HS_Code: 85423100; Wattage: NA; Project: AM64x-GP_EVM BRD; Footprint Path: Y:\MIS_DATABASE\Library\ALTIUM_TOOL\PCB_FOOTPRINTS\Altium_Footprint_Lib.PcbLib; Library Path: Y:\MIS_DATABASE\Library\ALTIUM_TOOL\SCHEMATICS_PARTS\MS_MISCPOWER_Library.schlib; MECHANICAL 3D STEP FILE: uSIP8_TPS82084_110X120_1-4; Chkd/date: MANIRAJA/090420; Crtd /date: ALVY/080420; Datasheet: Y:\MIS_DATABASE\DATASHEETS\ICS\POWER\TPS8208X.PDF; Temperature: -40癈+125癈; Weight: 580mg; Height: 1.33MM; Library Ref: TPS82084_uSIP8; Distributor_part_number: 296-42973-1-ND; Distributor_name: DIGIKEY; Package: uSIP8; Voltage: NA; Tolerance: NA; Mfr_part_number: TPS82084SILT; Footprint Ref: uSIP8_TPS82084_110X120_1-4; PCB Footprint: uSIP8_TPS82084_110X120_1-4
U25 = TPS62823_VSONHR8: IC 3A ADJ STEP-DOWN CONVERTER WITH 1% ACCURACY VSON-HR8; Mistral Part No: 142020050005-R; Mfr_name: TEXAS INSTRUMENTS; Part_type: ICS\POWER\DC-DC CONVERTER; Project: AM64x-GP_EVM BRD; Tolerance: NA; Customs_HS_Code: 85423100; Custom_Duty: 15%; Footprint Ref: VSONHR8_TPS62823_60X80_1; Mfr_part_number: TPS62823DLCT; Voltage: NA; Wattage: NA; Package: VSON-HR8; Distributor_name: DIGIKEY; Distributor_part_number: 296-50225-1-ND; Library Ref: TPS62823_VSONHR8; Height: 1.00MM; Weight: 6.2mg; Temperature: -40癈+125癈; Datasheet: Y:\MIS_DATABASE\DATASHEETS\ICS\POWER\TPS62821-2-3.PDF; Crtd /date: ALVY/070520; Chkd/date: MANIRAJA/080520; MECHANICAL 3D STEP FILE: VSONHR8_TPS62823_60X80_1; Library Path: Y:\MIS_DATABASE\Library\ALTIUM_TOOL\SCHEMATICS_PARTS\MS_MISCPOWER_Library.schlib; Footprint Path: Y:\MIS_DATABASE\Library\ALTIUM_TOOL\PCB_FOOTPRINTS\Altium_Footprint_Lib.PcbLib; PCB Footprint: VSONHR8_TPS62823_60X80_1
U33 = TPS74501_WSON6: IC 1A ADJ OUTPUT LDO WITH POWER-GOOD WSON6; Part_type: ICS\POWER\VOLTAGE REGULATOR; Mfr_name: TEXAS INSTRUMENTS; Mistral Part No: 142019060004-R; Custom_Duty: 15%; Customs_HS_Code: 85423100; Wattage: NA; Project: TI_MAXIE_CPB; PCB Footprint: SON6_25-59_85X85_0-8; Footprint Path: Y:\MIS_DATABASE\Library\ALTIUM_TOOL\PCB_FOOTPRINTS\Altium_Footprint_Lib.PcbLib; Library Path: Y:\MIS_DATABASE\Library\ALTIUM_TOOL\SCHEMATICS_PARTS\MS_MISCPOWER_Library.schlib; MECHANICAL 3D STEP FILE: SON6_25-59_85X85_0-8; Chkd/date: MANIRAJA/060619; Crtd /date: ALVY/060619; Datasheet: Y:\MIS_DATABASE\DATASHEETS\ICS\POWER\TPS74601.PDF; Temperature: -40癈+125癈; Weight: NA; Height: 0.80MM; Library Ref: TPS74501_WSON6; Distributor_part_number: 595-TPS74601PDRVR; Distributor_name: MOUSER; Package: WSON6; Voltage: NA; Tolerance: NA; Mfr_part_number: TPS74601PDRVR; Footprint Ref: SON6_25-59_85X85_0-8
U65 = TPS62085RLTR_VSONHR7: IC 3A 1.8V STEP DOWN CONVERTER WITH SHORT CIRCUIT PROTECTION VSON-HR7; Mistral Part No: 142018080020-R; Mfr_name: TEXAS INSTRUMENTS; Part_type: ICS\POWER\CONVERTER; Project: TI_MAXIE_CPB; Tolerance: NA; Customs_HS_Code: 85423100; Custom_Duty: 15%; Footprint Path: Y:\MIS_DATABASE\Library\ALTIUM_TOOL\PCB_FOOTPRINTS\Altium_Footprint_Lib.PcbLib; Library Path: Y:\MIS_DATABASE\Library\ALTIUM_TOOL\SCHEMATICS_PARTS\MS_MISCPOWER_Library.schlib; Footprint Ref: VSONHR7_TPS62085_80X80_1; Library Ref: TPS62085RLTR_VSONHR7; Mfr_part_number: TPS62087RLTT; Voltage: NA; Wattage: NA; Package: VSON-HR7; Distributor_name: DIGIKEY; Distributor_part_number: 296-37087-1-ND; Height: 1.00MM; Weight: 8.8mg; Temperature: -40癈+125癈; Datasheet: Y:\MIS_DATABASE\DATASHEETS\ICS\POWER\TPS62085.PDF; Crtd /date: MANIRAJA/310818; Chkd/date: MANIRAJA/310818; MECHANICAL 3D STEP FILE: VSONHR7_TPS62085_80X80_1; PCB Footprint: VSONHR7_TPS62085_80X80_1
U72 = TLV71318PDQNR_X2SON4: IC 500mA LOW IQ LDO REGULATOR X2SON-4; Part_type: ICS\POWER\VOLTAGE REGULATOR; Mfr_name: TEXAS INSTRUMENTS; Mistral Part No: 142020060013-R; Custom_Duty: 15%; Customs_HS_Code: 85423100; Wattage: NA; Project: AM64x-GP_EVM BRD; Footprint Path: Y:\MIS_DATABASE\Library\ALTIUM_TOOL\PCB_FOOTPRINTS\Altium_Footprint_Lib.PcbLib; Library Path: Y:\MIS_DATABASE\Library\ALTIUM_TOOL\SCHEMATICS_PARTS\MS_MISCPOWER_Library.schlib; MECHANICAL 3D STEP FILE: X2SON4_TLV71318P_40X40_0-4; Crtd /date: ALVY/160620; Datasheet: Y:\MIS_DATABASE\DATASHEETS\ICS\POWER\TLV755P.PDF; Temperature: -40癈+125癈; Weight: 1.1mg; Height: 0.40MM; Library Ref: TLV71318PDQNR_X2SON4; Distributor_part_number: 296-51790-1-ND; Distributor_name: DIGIKEY; Package: X2SON-4; Voltage: NA; Tolerance: NA; Mfr_part_number: TLV75518PDQNR; Footprint Ref: X2SON4_TLV71318P_40X40_0-4; PCB Footprint: X2SON4_TLV71318P_40X40_0-4
U103 = SN74LVC1G32DBVR_SOT23-5: IC SINGAL 2 INPUT POSITIVE OR GATE SOT23-5; Part_type: ICS\DIGITAL\GATES; Mfr_name: TEXAS INSTRUMENTS; Mistral Part No: 141009030236-R; Custom_Duty: 15%; Customs_HS_Code: 85423100; Wattage: NA; Project: SVDO_RMB_MMA; MECHANICAL 3D STEP FILE: SOT23-5_1-5; Chkd/date: MANIRAJA/051017; Crtd /date: MAZHAR/070806; Datasheet: Y:\MIS_DATABASE\DATASHEETS\ICS\DIGITAL\GATES\SN74LVC1G32.PDF; Temperature: -40癈+85癈; Weight: 6.3mg; Height: 1.45MM; Distributor_part_number: 296-9847-1-ND; Distributor_name: DIGIKEY; Package: SOT23-5; Voltage: NA; Tolerance: NA; Mfr_part_number: SN74LVC1G32DBVR; PCB Footprint: SOT23-5_1-5
U104 = SN74LVC1G08DBVRE4_SOT23-5: IC SINGLE 2-INPUT POSITIVE AND GATE SOT23-5; Part_type: ICS\DIGITAL\GATES; Mfr_name: TEXAS INSTRUMENTS; Mistral Part No: 141009060026-R; Custom_Duty: 15%; Customs_HS_Code: 85423100; Project: KHAN_MAIN; RoHS: Sb/ Br FREE; Chkd/date: SUHAS/221010; Crtd /date: USMAN/151008; Datasheet: Y:\MIS_DATABASE\DATASHEETS\ICS\DIGITAL\GATES\SN74LVC1G08.PDF; Temperature: -40癈+85癈; Height: 1.45MM; Library Ref: SN74LVC1G08DBVRE4_SOT23-5; Distributor_part_number: SN74LVC1G08DBVRE4-ND; Distributor_name: DIGIKEY; Package: SOT23-5; Mfr_part_number: SN74LVC1G08DBVRE4; PCB Footprint: SOT23-5